# Altium schematic sheet Sheet_X_buzzer.SchDoc
size A4
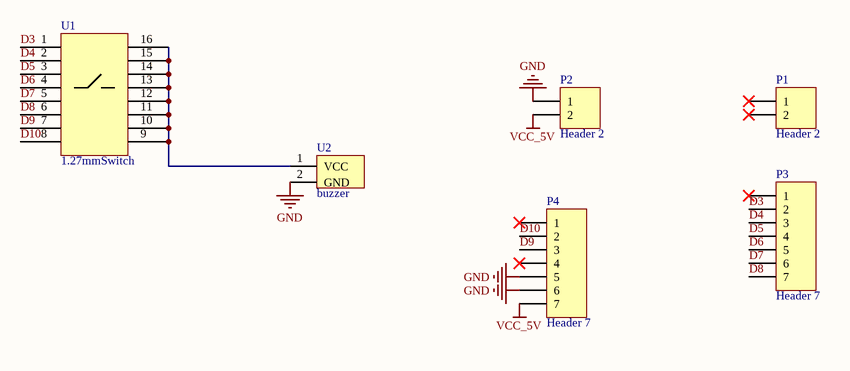
[diagram p0: Sheet_X_buzzer.SchDoc]

## Parts
P1  Header 2  [HDR1X2]
P2  Header 2  [HDR1X2]
P3  Header 7  [HDR1X7]
P4  Header 7  [HDR1X7]
U1  1.27mmSwitch  [NumberSwitch]
U2  buzzer  [buzzer]

## Nets
GND: P2.1 P4.5 P4.6 U2.2(GND)
VCC_5V: P2.2 P4.7
D3: P3.2 U1.1
D4: P3.3 U1.2
D5: P3.4 U1.3
D6: P3.5 U1.4
D7: P3.6 U1.5
D8: P3.7 U1.6
D9: P4.3 U1.7
D10: P4.2 U1.8
NetU1_9: U1.9 U1.10 U1.11 U1.12 U1.13 U1.14 U1.15 U1.16 U2.1(VCC)

Not connected (* = marked no-connect by the designer): P1 1* 2*; P3 1*; P4 1* 4*

## Library data of the parts
P1 P2 = Header 2: Header, 2-Pin; LatestRevisionDate: 17-Jul-2002; LatestRevisionNote: Re-released for DXP Platform.; Publisher: Altium Limited
P3 P4 = Header 7: Header, 7-Pin; LatestRevisionDate: 17-Jul-2002; LatestRevisionNote: Re-released for DXP Platform.; Publisher: Altium Limited
U1 = NumberSwitch: 拨码开关
U2 = buzzer: 3V蜂鸣器